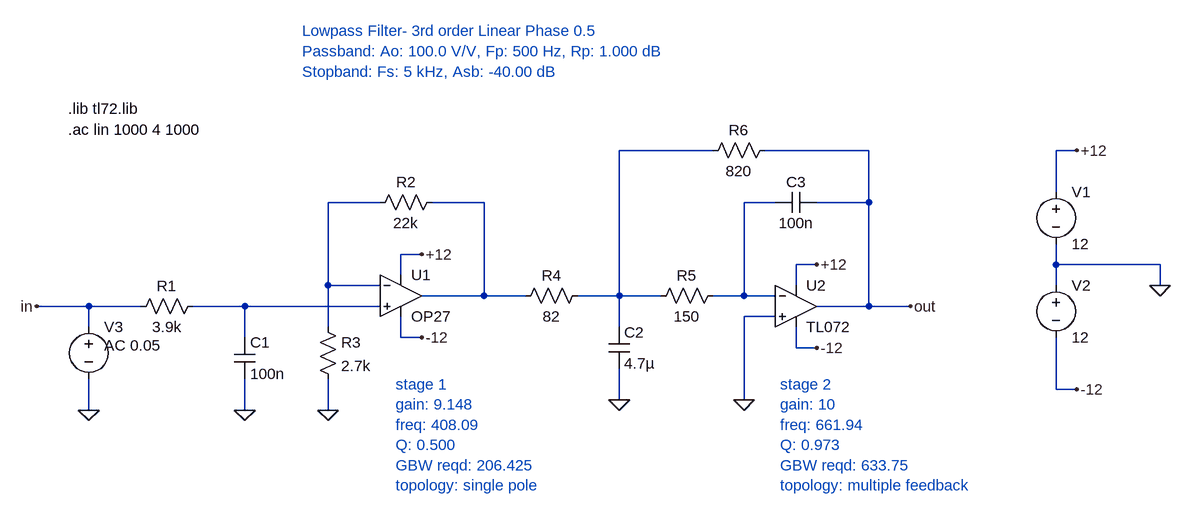
[diagram p0: schematic ti_LPF_3rd_order_linear_phase_05.asc]
ti_LPF_3rd_order_linear_phase_05.asc, the LTspice schematic file:
Version 4
SHEET 1 1380 680
WIRE 672 -144 528 -144
WIRE 912 -144 752 -144
WIRE 1232 -144 1200 -144
WIRE 1200 -80 1200 -144
WIRE 160 -64 80 -64
WIRE 320 -64 240 -64
WIRE 768 -64 720 -64
WIRE 912 -64 912 -144
WIRE 912 -64 832 -64
WIRE 224 16 192 16
WIRE 832 32 800 32
WIRE 1200 32 1200 0
WIRE 1360 32 1200 32
WIRE 192 48 192 16
WIRE 80 64 80 -64
WIRE 160 64 80 64
WIRE 800 64 800 32
WIRE 1200 64 1200 32
WIRE 1360 64 1360 32
WIRE 320 80 320 -64
WIRE 320 80 224 80
WIRE 384 80 320 80
WIRE 528 80 528 -144
WIRE 528 80 464 80
WIRE 592 80 528 80
WIRE 720 80 720 -64
WIRE 720 80 672 80
WIRE 768 80 720 80
WIRE -288 96 -368 96
WIRE -208 96 -288 96
WIRE -48 96 -128 96
WIRE 160 96 -48 96
WIRE 912 96 912 -64
WIRE 912 96 832 96
WIRE 976 96 912 96
WIRE 768 112 720 112
WIRE -288 128 -288 96
WIRE 80 128 80 64
WIRE 528 128 528 80
WIRE -48 144 -48 96
WIRE 192 144 192 112
WIRE 224 144 192 144
WIRE 800 160 800 128
WIRE 832 160 800 160
WIRE 1200 224 1200 144
WIRE 1232 224 1200 224
WIRE 528 240 528 192
WIRE 720 240 720 112
WIRE -288 256 -288 208
WIRE -48 256 -48 208
WIRE 80 256 80 208
FLAG -48 256 0
FLAG 1360 64 0
FLAG 1232 -144 +12
FLAG 1232 224 -12
FLAG 224 144 -12
FLAG 224 16 +12
FLAG 80 256 0
FLAG -368 96 in
FLAG -288 256 0
FLAG 528 240 0
FLAG 720 240 0
FLAG 832 160 -12
FLAG 832 32 +12
FLAG 976 96 out
SYMBOL res -112 80 R90
WINDOW 0 0 56 VBottom 2
WINDOW 3 32 56 VTop 2
SYMATTR InstName R1
SYMATTR Value 3.9k
SYMBOL cap -64 144 R0
SYMATTR InstName C1
SYMATTR Value 100n
SYMBOL OpAmps\\opamp2 800 32 R0
SYMATTR InstName U2
SYMATTR Value TL072
SYMBOL voltage 1200 -96 R0
WINDOW 123 0 0 Left 0
WINDOW 39 0 0 Left 0
SYMATTR InstName V1
SYMATTR Value 12
SYMBOL voltage 1200 48 R0
WINDOW 123 0 0 Left 0
WINDOW 39 0 0 Left 0
SYMATTR InstName V2
SYMATTR Value 12
SYMBOL res 256 -80 R90
WINDOW 0 0 56 VBottom 2
WINDOW 3 32 56 VTop 2
SYMATTR InstName R2
SYMATTR Value 22k
SYMBOL res 64 112 R0
SYMATTR InstName R3
SYMATTR Value 2.7k
SYMBOL voltage -288 112 R0
WINDOW 123 24 44 Left 2
WINDOW 39 0 0 Left 0
WINDOW 3 24 44 Left 2
SYMATTR Value2 AC 0.05
SYMATTR Value ""
SYMATTR InstName V3
SYMBOL res 480 64 R90
WINDOW 0 0 56 VBottom 2
WINDOW 3 32 56 VTop 2
SYMATTR InstName R4
SYMATTR Value 82
SYMBOL res 688 64 R90
WINDOW 0 0 56 VBottom 2
WINDOW 3 32 56 VTop 2
SYMATTR InstName R5
SYMATTR Value 150
SYMBOL cap 512 128 R0
SYMATTR InstName C2
SYMATTR Value 4.7µ
SYMBOL cap 832 -80 R90
WINDOW 0 0 32 VBottom 2
WINDOW 3 32 32 VTop 2
SYMATTR InstName C3
SYMATTR Value 100n
SYMBOL res 768 -160 R90
WINDOW 0 0 56 VBottom 2
WINDOW 3 32 56 VTop 2
SYMATTR InstName R6
SYMATTR Value 820
SYMBOL OpAmps\\OP27 192 16 R0
SYMATTR InstName U1
TEXT -320 -208 Left 2 !.lib tl72.lib
TEXT -320 -176 Left 2 !.ac lin 1000 4 1000
TEXT 40 -328 Left 2 ;Lowpass Filter- 3rd order Linear Phase 0.5\nPassband: Ao: 100.0 V/V, Fp: 500 Hz, Rp: 1.000 dB\nStopband: Fs: 5 kHz, Asb: -40.00 dB
TEXT 184 216 Left 2 ;stage 1\ngain: 9.148\nfreq: 408.09\nQ: 0.500\nGBW reqd: 206.425\ntopology: single pole
TEXT 776 216 Left 2 ;stage 2\ngain: 10\nfreq: 661.94\nQ: 0.973\nGBW reqd: 633.75\ntopology: multiple feedback

The netlist it stands for:
* ti_LPF_3rd_order_linear_phase_05.asc
R1 N005 in 3.9k
C1 N005 0 100n
XU2 0 N004 +12 -12 out TL072  ; pins In+ In- V+ V- OUT
V1 +12 0 12
V2 0 -12 12
R2 N003 N002 22k
R3 N002 0 2.7k
V3 in 0 AC 0.05
R4 N001 N003 82
R5 N004 N001 150
C2 N001 0 4.7µ
C3 out N004 100n
R6 out N001 820
XU1 N005 N002 +12 -12 N003 OP27  ; pins In+ In- V+ V- OUT
.lib tl72.lib
.ac lin 1000 4 1000
* Lowpass Filter- 3rd order Linear Phase 0.5
* Passband: Ao: 100.0 V/V, Fp: 500 Hz, Rp: 1.000 dB
* Stopband: Fs: 5 kHz, Asb: -40.00 dB
* stage 1
* gain: 9.148
* freq: 408.09
* Q: 0.500
* GBW reqd: 206.425
* topology: single pole
* stage 2
* gain: 10
* freq: 661.94
* Q: 0.973
* GBW reqd: 633.75
* topology: multiple feedback
.lib ADI.lib
.backanno
.end